# EAGLE design connectors (EAGLE 9.6.2)
Assembly variants: BASIC
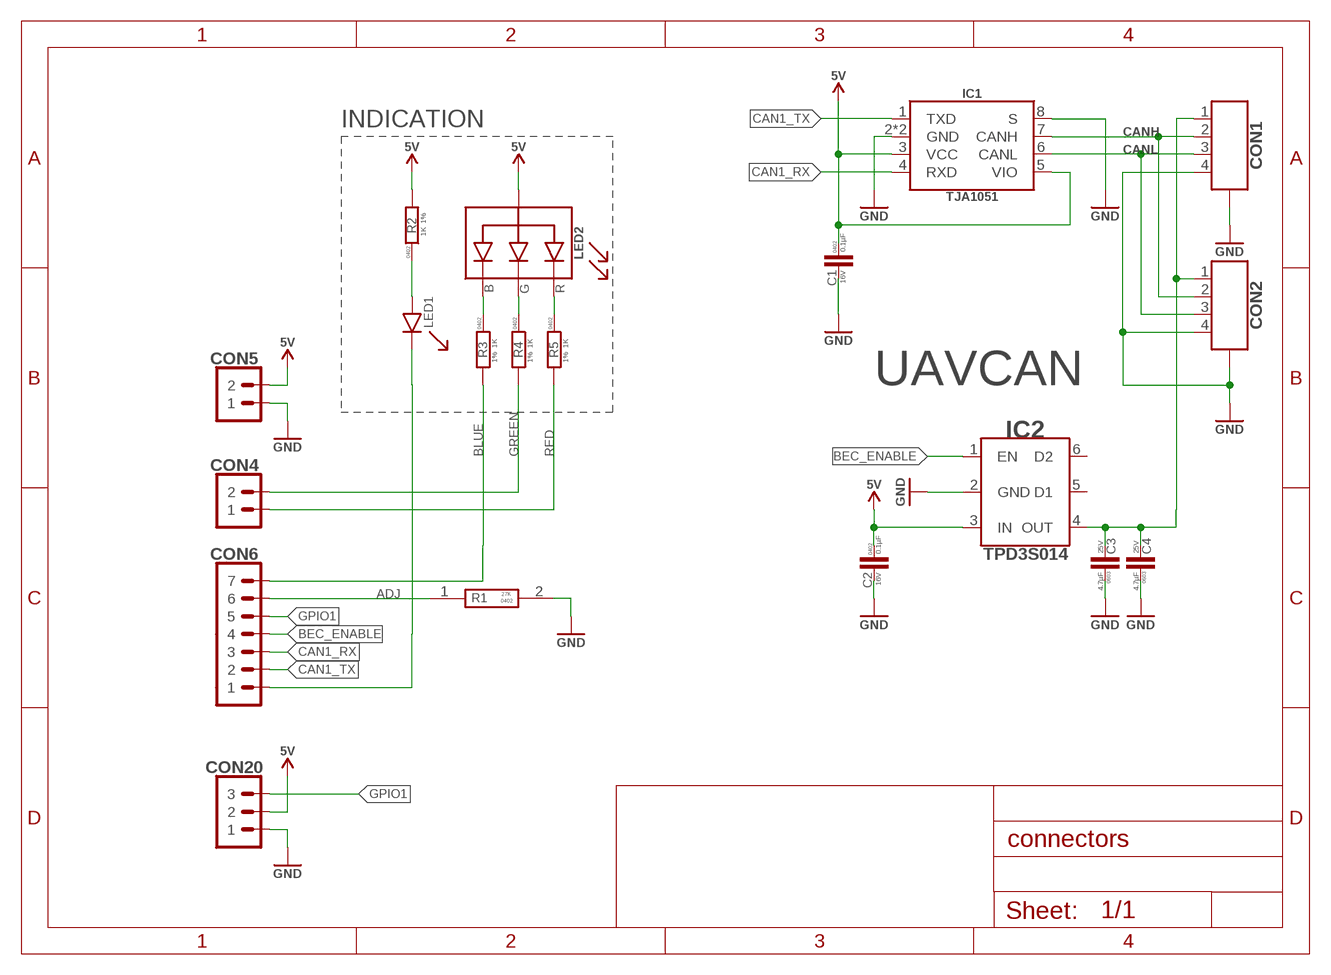
[diagram p0: schematic, sheet 1]

## Parts
C1  0.1µF  0.1µF-16V_10%_X7R-0402  [C0402]
C2  0.1µF  0.1µF-16V_10%_X7R-0402  [C0402]
C3  4.7µF  4.7µF-25V_10%_X6S-0603  [C0603]
C4  4.7µF  4.7µF-25V_10%_X6S-0603  [C0603]
CON1  CON-4P-TABS-JST_GH-RA  [JST_GH-4P-RA]
CON2  CON-4P-TABS-JST_GH-RA  [JST_GH-4P-RA]
CON4  PINHEAD_1X02-2  [1X02-PTH-2]  (not fitted in variant BASIC)
CON5  PINHEAD_1X02-2  [1X02-PTH-2]  (not fitted in variant BASIC)
CON6  PINHEAD_1X07-2  [1X07-PTH-2]  (not fitted in variant BASIC)
CON20  PINHEAD_1X03-2.54-RA  [1X03-PTH-2.54-RA]  (not fitted in variant BASIC)
IC1  TJA1051  [SOT782-1]
IC2  TPD3S014DBVR-SOT23-6  [SOT26]
LED1  GREEN  LED-GREEN-0402  [0402_LED]
LED2  LTST-C19HE1WT  [LITE_ON_RGB_LED]
R1  27K  RC0402FR-0727KL  [RESC1005X40N]
R2  1K  1K-1%-0402  [R0402]
R3  1K  1K-1%-0402  [R0402]
R4  1K  1K-1%-0402  [R0402]
R5  1K  1K-1%-0402  [R0402]

## Nets
ADJ: CON6.6 R1.1
BEC_ENABLE: CON6.4 IC2.1(EN)
BLUE: CON6.7 R3.2
CAN1_LED: CON6.1 LED1.C
CAN1_RX: CON6.3 IC1.4(RXD)
CAN1_TX: CON6.2 IC1.1(TXD)
CAN1_VDD: C3.P$2 C4.P$2 CON1.1 CON2.1 IC2.4(OUT)
CANH: CON1.2 CON2.2 IC1.7(CANH)
CANL: CON1.3 CON2.3 IC1.6(CANL)
GND: C1.2 C2.2 C3.P$1 C4.P$1 CON1.4 CON1.M$0(GND) CON1.M$1(GND) CON2.4 CON2.M$0(GND) CON2.M$1(GND) CON5.1 CON20.1 IC1.2(GND) IC1.8(S) IC1.PAD(GND) IC2.2(GND) R1.2
GPIO1: CON6.5 CON20.3
GREEN: CON4.2 R4.2
N$7: LED1.A R2.1
N$58: LED2.R R5.1
N$59: LED2.G R4.1
N$60: LED2.B R3.1
RED: CON4.1 R5.2
VDD_5V: C1.1 C2.1 CON5.2 CON20.2 IC1.3(VCC) IC1.5(VIO) IC2.3(IN) LED2.+(A) R2.2 ; supply symbol labelled 5V
Unconnected: IC2.5(D1) IC2.6(D2)

## Notes on the sheet
- INDICATION
- UAVCAN

## Library data of the parts
C1 C2 = C_digikey:0.1µF; DIGIKEY#: 490-3261-1-ND; MANF: Murata Electronics North America; MANF#: GRM155R71C104KA88D; OPERATING_TEMP: -55°C ~ 125°C; PACKAGE: 0402; TC: X7R; TOLERANCE: +-10%; VOLTAGE: 16V
C3 C4 = C_digikey:4.7µF; DIGIKEY#: 490-7199-1-ND; MANF: Murata Electronics North America; MANF#: GRM188C81E475KE11D; OPERATING_TEMP: -55°C ~ 105°C; PACKAGE: 0603; TC: X6S; TOLERANCE: +-10%; VOLTAGE: 25V
CON1 CON2 = Connectors:CON-4P-TABS: Connector Receptacle 4 Position 0.049" (1.25mm) Tin Surface Mount; DIGIKEY#: 455-1566-1-ND; MANF: JST Sales America Inc; MANF#: SM04B-GHS-TB(LF)(SN)
CON4 CON5 = pinhead:PINHEAD_1X02: pinheader 2P
CON6 = pinhead:PINHEAD_1X07: pinheader 7P
CON20 = pinhead:PINHEAD_1X03: pinheader 3P
IC1 = myxa_masterlib:TJA1051: 1/1 Transceiver Half CAN 8-HVSON (3x3); DIGIKEY#: 568-8686-2-ND; MANF: NXP Semiconductors; MANF#: TJA1051TK/3,118
IC2 = myxa_masterlib:TPD3S014DBVR; DIGIKEY#: 296-38835-1-ND; MANF: Texas Instruments; MANF#: TPD3S014DBVR
LED1 = myxa_masterlib:LED; COLOR: GREEN; DIGIKEY#: 511-1652-1-ND; MANF: Rohm Semiconductor; MANF#: SML-P11MTT86
LED2 = myxa_masterlib:LTST-C19HE1WT; DIGIKEY#: 160-2162-1-ND; MANF: Lite-On Inc; MANF#: LTST-C19HE1WT
R1 = RC0402FR-0727KL:RC0402FR-0727KL: YAGEO - RC0402FR-0727KL - SMD Chip Resistor, 27 kohm, +/- 1%, 62.5 mW, 0402 [1005 Metric], Thick Film, General Purpose Source: Datasheet <https://www.yageo.com/upload/media/product/productsearch/datasheet/rchip/PYu-RC_Group_51_RoHS_L_12.pdf>; DESCRIPTION: YAGEO - AF0402FR-0727KL - SMD Chip Resistor, 27 kohm, +/- 1%, 62.5 mW, 0402 [1005 Metric], Thick Film, General Purpose; HEIGHT: 0.32mm; MANF: YAGEO; MANF#: AF0402FR-0727KL; MANUFACTURER_NAME: YAGEO; MANUFACTURER_PART_NUMBER: AF0402FR-0727KL; PACKAGE: 0402
R2-R5 = R_digikey:1K; DIGIKEY#: 311-1.00KLRCT-ND; MANF: Yageo; MANF#: RC0402FR-071KL; PACKAGE: 0402; TOLERANCE: 1%

## Net classes
1 HV: clearance 0.25 mm to class 0, clearance 0.25 mm

## Board
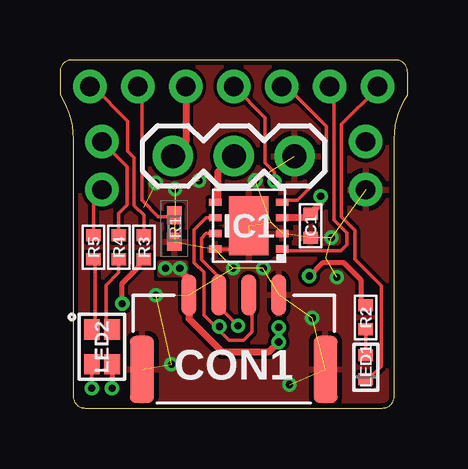
[diagram p1: board, top side]
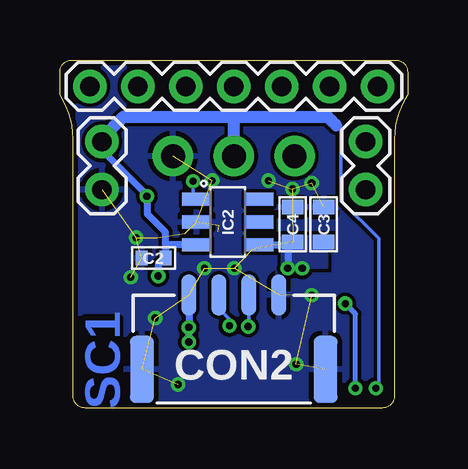
[diagram p2: board, bottom side, seen from below]

Size 14.5 x 14.5 mm. Coordinates in mm from the lower left corner, seen from the top.
Outline: 14.5,14 arc90 14,14.5 0.5,14.5 arc90 0,14 0,13.05 arc-33 0.55,11.2 0.55,0.5 arc90 1.05,0 13.45,0 arc90 13.95,0.5 13.95,11.2 arc-33 14.5,13.05 14.5,14
Copper layers (1*16): Top 0.035mm / dielectric 0.5mm / Bottom 0.035mm
Design rules "myxa *": minimum track width 0.15mm, minimum drill 0.2mm, track to track 0.15mm, track to pad 0.15mm, pad to pad 0.15mm, via to via 0.15mm, smd to smd 0.15mm, copper to edge 0.2mm, drill to drill 0.2mm, minimum pad ring 0.125mm, minimum via ring 0.125mm, stop-mask expansion 1mil, vias tented up to drill 0.31mm, thermal gap 8mil

### Footprints (pad centres in the part's own frame; a part is rotated, then mirrored left to right if it is on the bottom)
C0402 = smd 0.5 x 0.6: 1 -0.5,0; 2 0.5,0
C0603 = smd 0.6 x 0.9: P$1 -0.725,0; P$2 0.725,0
JST_GH-4P-RA = smd 0.6 x 1.7: 1 1.875,-2.91; 2 0.625,-2.91; 3 -0.625,-2.91; 4 -1.875,-2.91 | smd 1 x 2.8: M$0 -3.825,0.19; M$1 3.825,0.19
1X02-PTH-2 = drill 0.8 pad 1.4: 1 -1,0; 2 1,0
1X07-PTH-2 = drill 0.8 pad 1.4: 1 -6,0; 2 -4,0; 3 -2,0; 4 0,0; 5 2,0; 6 4,0; 7 6,0
1X03-PTH-2.54-RA = drill 1 pad 1.7: 1 -2.54,0; 2 0,0; 3 2.54,0
SOT782-1 = smd 0.525 x 0.3: 1 -1.4,0.975; 2 -1.4,0.325; 3 -1.4,-0.325; 4 -1.4,-0.975; 5 1.4,-0.975; 6 1.4,-0.325; 7 1.4,0.325; 8 1.4,0.975 | smd 1.65 x 2.45: PAD 0,0
SOT26 = smd 1.2 x 0.55: 1 -1.3,0.95; 2 -1.3,0; 3 -1.3,-0.95; 4 1.3,-0.95; 5 1.3,0; 6 1.3,0.95
0402_LED = smd 0.5 x 0.6: A 0.5,0; C -0.5,0
LITE_ON_RGB_LED = smd 0.65 x 0.85: + -0.425,-0.725; B 0.425,-0.725; G 0.425,0.725; R -0.425,0.725
RESC1005X40N = smd 0.75 x 0.6: 1 -0.55,0; 2 0.55,0
R0402 = smd 0.5 x 0.6: 1 -0.5,0; 2 0.5,0

### Placement (x,y rotation side)
C1  10.45,7.6 270 top
C2  10.6,6.25 180 bottom
C3  3.5,7.65 270 bottom
C4  4.8,7.65 270 bottom
CON1  7.25,1.8 180 top
CON2  7.25,1.8 180 bottom
CON4  1.75,10.1 90 bottom
CON5  12.75,10.1 90 bottom
CON6  7.25,13.4 0 bottom
CON20  7.25,10.5 180 top
IC1  7.88,7.6 180 top
IC2  7.5,7.75 0 bottom
LED1  12.75,1.7 90 top
LED2  1.75,2.55 0 top
R1  4.78,7.47 270 top
R2  12.75,3.77 90 top
R3  3.5,6.7 90 top
R4  2.45,6.7 90 top
R5  1.4,6.7 90 top

### Tracks (layer width: path | path; a pad name or v marks a point on that pad's centre or on a via)
ADJ  (1 unrouted)
  Top 0.15: CON6.6 3.42,13.22 3.42,12.57
  Top 0.152: 4.8,7.97 4.1,7.97 3.42,8.65 3.42,12.57
BEC_ENABLE  (via drill 0.3 pad 0.6)
  Top 0.152: CON6.4 8.55,12.1 8.55,10.22 8.95,9.82 v8.95,9.45
  Bottom 0.152: IC2.1 arc90 8.95,8.85 v8.95,9.45
BLUE
  Top 0.15: R3.2 3.5,8.03 3.1,8.43 3.1,10.43 2.83,10.7 2.83,11.95 1.38,13.4 CON6.7
CAN1_LED
  Top 0.152: LED1.C 12.85,1.2 13.4,1.75 13.4,5.1 12.3,6.2 12.3,7.4 11.74,7.96 11.74,11.81 13.25,13.32 CON6.1
CAN1_RX
  Top 0.152: IC1.4 9.35,8.65 9.9,8.65 11.12,9.87 11.12,11.73 9.45,13.4 CON6.3
CAN1_TX
  Top 0.152: IC1.1 9.36,6.55 11.72,6.55 11.97,6.8 11.97,7.3 11.42,7.85 11.42,13.23 CON6.2
CAN1_VDD  (via drill 0.3 pad 0.6)
  Top 0.3: v5,5.83 5,5.72 5.38,5.35 CON1.1 5.38,3.73 6.75,2.35 8.72,2.35 v9.12,2.75 v9.12,3.36
  Bottom 0.3: IC2.4 4.92,6.8 C4.P$2 5,6.72 v5,5.83 | v9.12,2.75 v9.12,3.36 CON2.1
  other vias: 4.4,5.83
  pour Bottom (no thermals): 3.4,7.1 5.2,7.1 5.2,5.9 3.4,5.9
  pour Top (no thermals): 5.25,6.05 4.15,6.05 4.15,5.55 5.25,5.55
CANH  (via drill 0.3 pad 0.6)
  Top 0.152: IC1.7 6.1,7.28 5.9,7.08 5.9,6.5 5.9,6.17 6.62,5.45 CON1.2 6.62,4.22 v7.42,3.42
  Bottom 0.152: v7.42,3.42 7.42,3.7 7.88,4.15 CON2.2
CANL  (via drill 0.3 pad 0.6)
  Top 0.152: IC1.6 6.1,7.92 5.6,7.42 5.6,6.05 6,5.65 6,3.88 6.47,3.4 v6.65,3.4 6.65,3.23 7.05,2.83 7.65,2.83 8,3.17 8,4.58 CON1.3
  Bottom 0.152: CON2.3 6.62,3.42 v6.65,3.4
GND  (via drill 0.3 pad 0.6)  (28 unrouted)
  Top 0.152: IC1.8 7.19,6.62 7.91,7.35
  other vias: 11.32,7.1 4.65,1.82 9.57,0.98 10.53,3.75 11.55,5.45 4,4.7 8.47,5.83 8.15,9.47 4.8,9.12 5.8,9.47 4,9.38 7.22,5.83
  pour Bottom (rank 3): 13.75,14.53 0.75,14.53 0.75,0.02 13.75,0.02
  pour Top (rank 3): 0.75,14.53 13.75,14.53 13.75,0.02 0.75,0.02
GPIO1
  Top 0.3: CON6.5 5.25,11.08 CON20.3
GREEN
  Top 0.15: R4.2 2.45,8.12 2.8,8.47 2.8,10.05 CON4.2
N$7
  Top 0.152: LED1.A R2.1
N$58
  Top 0.152: LED2.R 1.47,3.42 1.47,6.12 R5.1
N$59
  Top 0.152: LED2.G 1.92,3.52 1.92,5.12 2.45,5.65 R4.1
N$60  (via drill 0.3 pad 0.6)
  Top 0.2: LED2.B v2.17,0.82 | v2.6,4.35 2.6,5.2 3.3,5.9 3.3,6 R3.1
  Bottom 0.2: v2.6,4.35 2.17,3.92 v2.17,0.82
RED
  Top 0.15: R5.2 1.4,8.75 CON4.1
VDD_5V  (via drill 0.3 pad 0.6)
  Top 0.15: LED2.+ v1.33,0.82
  Top 0.2: R2.2 12.55,4.47 12.55,5.35 11.85,6.05 10.95,6.05 v10.4,5.5
  Top 0.3: IC1.3 10.28,7.92 C1.1 10.88,8.53 v10.88,8.82 | IC1.5 6.58,8.68 6.58,9.82 CON20.2
  Bottom 0.152: v1.33,0.82 1.2,0.95 1.2,7.07 2.78,8.64 2.78,11.57 3.17,11.97 2.97,11.78
  Bottom 0.3: v10.88,8.82 10.85,8.82 10.85,8.85 | 10.1,6.83 10.1,7.33 10.85,8.07 10.85,8.85 | 10.1,6.83 C2.1 10.4,5.95 v10.4,5.5 | IC2.3 10.07,6.8 10.1,6.83 | CON5.2 12.75,10.75 10.85,8.85
  Bottom 0.5: CON5.2 12.75,11.22 11.84,12.14 7.25,12.14 | 2.97,11.78 3.17,11.97 3.34,12.14 7.25,12.14 | CON20.2 7.25,12.14

### Text on the board
Bottom: SC1